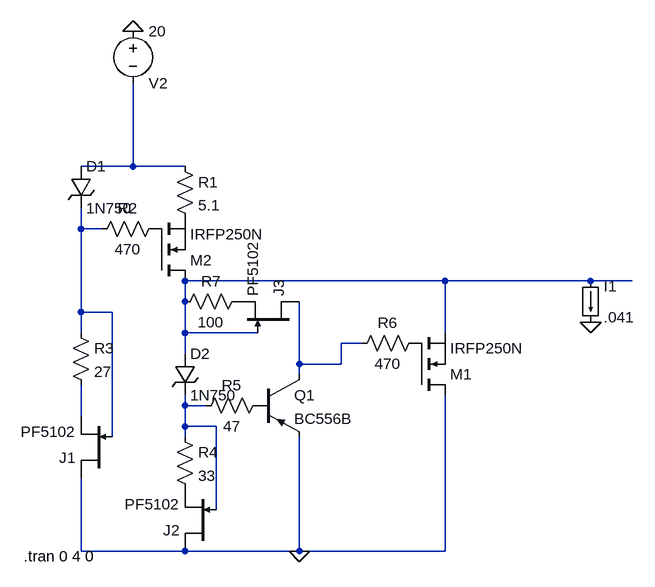
[diagram p0: schematic SALASSHUNTNEG.asc]
SALASSHUNTNEG.asc, the LTspice schematic file:
Version 4
SHEET 1 984 680
WIRE 112 -16 112 -144
WIRE 112 -16 32 -16
WIRE 192 -16 112 -16
WIRE 32 80 32 48
WIRE 64 80 32 80
WIRE 512 160 192 160
WIRE 592 160 512 160
WIRE 816 160 592 160
WIRE 880 160 816 160
WIRE 192 192 192 160
WIRE 32 208 32 80
WIRE 80 208 32 208
WIRE 32 240 32 208
WIRE 192 240 192 192
WIRE 304 240 192 240
WIRE 592 240 592 160
WIRE 464 256 432 256
WIRE 192 272 192 240
WIRE 368 288 368 192
WIRE 432 288 432 256
WIRE 432 288 368 288
WIRE 368 304 368 288
WIRE 192 352 192 336
WIRE 224 352 192 352
WIRE 32 368 32 320
WIRE 192 384 192 352
WIRE 240 384 192 384
WIRE 80 400 80 208
WIRE 192 400 192 384
WIRE 240 512 240 384
WIRE 32 576 32 464
WIRE 192 576 32 576
WIRE 368 576 368 400
WIRE 368 576 192 576
WIRE 592 576 592 336
WIRE 592 576 368 576
FLAG 112 -224 0
FLAG 368 576 0
FLAG 816 224 0
DATAFLAG 512 160 ""
SYMBOL res 176 -32 R0
SYMATTR InstName R1
SYMATTR Value 5.1
SYMBOL res 160 64 R90
WINDOW 0 0 56 VBottom 2
WINDOW 3 32 56 VTop 2
SYMATTR InstName R2
SYMATTR Value 470
SYMBOL res 320 336 R90
WINDOW 0 0 56 VBottom 2
WINDOW 3 32 56 VTop 2
SYMATTR InstName R5
SYMATTR Value 47
SYMBOL res 560 240 R90
WINDOW 0 0 56 VBottom 2
WINDOW 3 32 56 VTop 2
SYMATTR InstName R6
SYMATTR Value 470
SYMBOL load 800 160 R0
WINDOW 123 0 0 Left 2
WINDOW 39 0 0 Left 2
SYMATTR InstName I1
SYMATTR Value .041
SYMBOL zener 16 -16 R0
SYMATTR InstName D1
SYMATTR Value 1N750
SYMBOL zener 176 272 R0
SYMATTR InstName D2
SYMATTR Value 1N750
SYMBOL pnp 304 304 R0
SYMATTR InstName Q1
SYMATTR Value BC556B
SYMBOL njf 240 576 R180
SYMATTR InstName J2
SYMATTR Value PF5102
SYMBOL res 176 384 R0
SYMATTR InstName R4
SYMATTR Value 33
SYMBOL njf 80 464 R180
SYMATTR InstName J1
SYMATTR Value PF5102
SYMBOL res 16 224 R0
SYMATTR InstName R3
SYMATTR Value 27
SYMBOL njf 368 240 M270
SYMATTR InstName J3
SYMATTR Value PF5102
SYMBOL res 288 176 R90
WINDOW 0 0 56 VBottom 2
WINDOW 3 32 56 VTop 2
SYMATTR InstName R7
SYMATTR Value 100
SYMBOL voltage 112 -240 R0
WINDOW 0 24 96 Left 2
WINDOW 3 24 16 Left 2
WINDOW 123 0 0 Left 2
WINDOW 39 0 0 Left 2
SYMATTR InstName V2
SYMATTR Value 20
SYMBOL nmos 544 336 M180
SYMATTR InstName M1
SYMATTR Value IRFP250N
SYMBOL nmos 144 160 M180
SYMATTR InstName M2
SYMATTR Value IRFP250N
TEXT -56 584 Left 2 !.tran 0 4 0

The netlist it stands for:
* SALASSHUNTNEG.asc
R1 N001 P001 5.1
R2 P002 N002 470
R5 P003 N005 47
R6 P004 N004 470
I1 N003 0 .041
D1 N001 N002 1N750
D2 N003 N005 1N750
Q1 N004 P003 0 0 BC556B
J2 0 N005 P005 PF5102
R4 N005 P005 33
J1 0 N002 N006 PF5102
R3 N002 N006 27
J3 N004 N003 P006 PF5102
R7 P006 N003 100
V2 0 N001 20
M1 0 P004 N003 N003 IRFP250N
M2 N003 P002 P001 P001 IRFP250N
.model D D
.lib standard.dio
.model NPN NPN
.model PNP PNP
.lib standard.bjt
.model NJF NJF
.model PJF PJF
.lib standard.jft
.model NMOS NMOS
.model PMOS PMOS
.lib standard.mos
.tran 0 4 0
.backanno
.end